# EAGLE schematic PIClab1 (EAGLE 7.5.0)

## Sheet 1 of 2
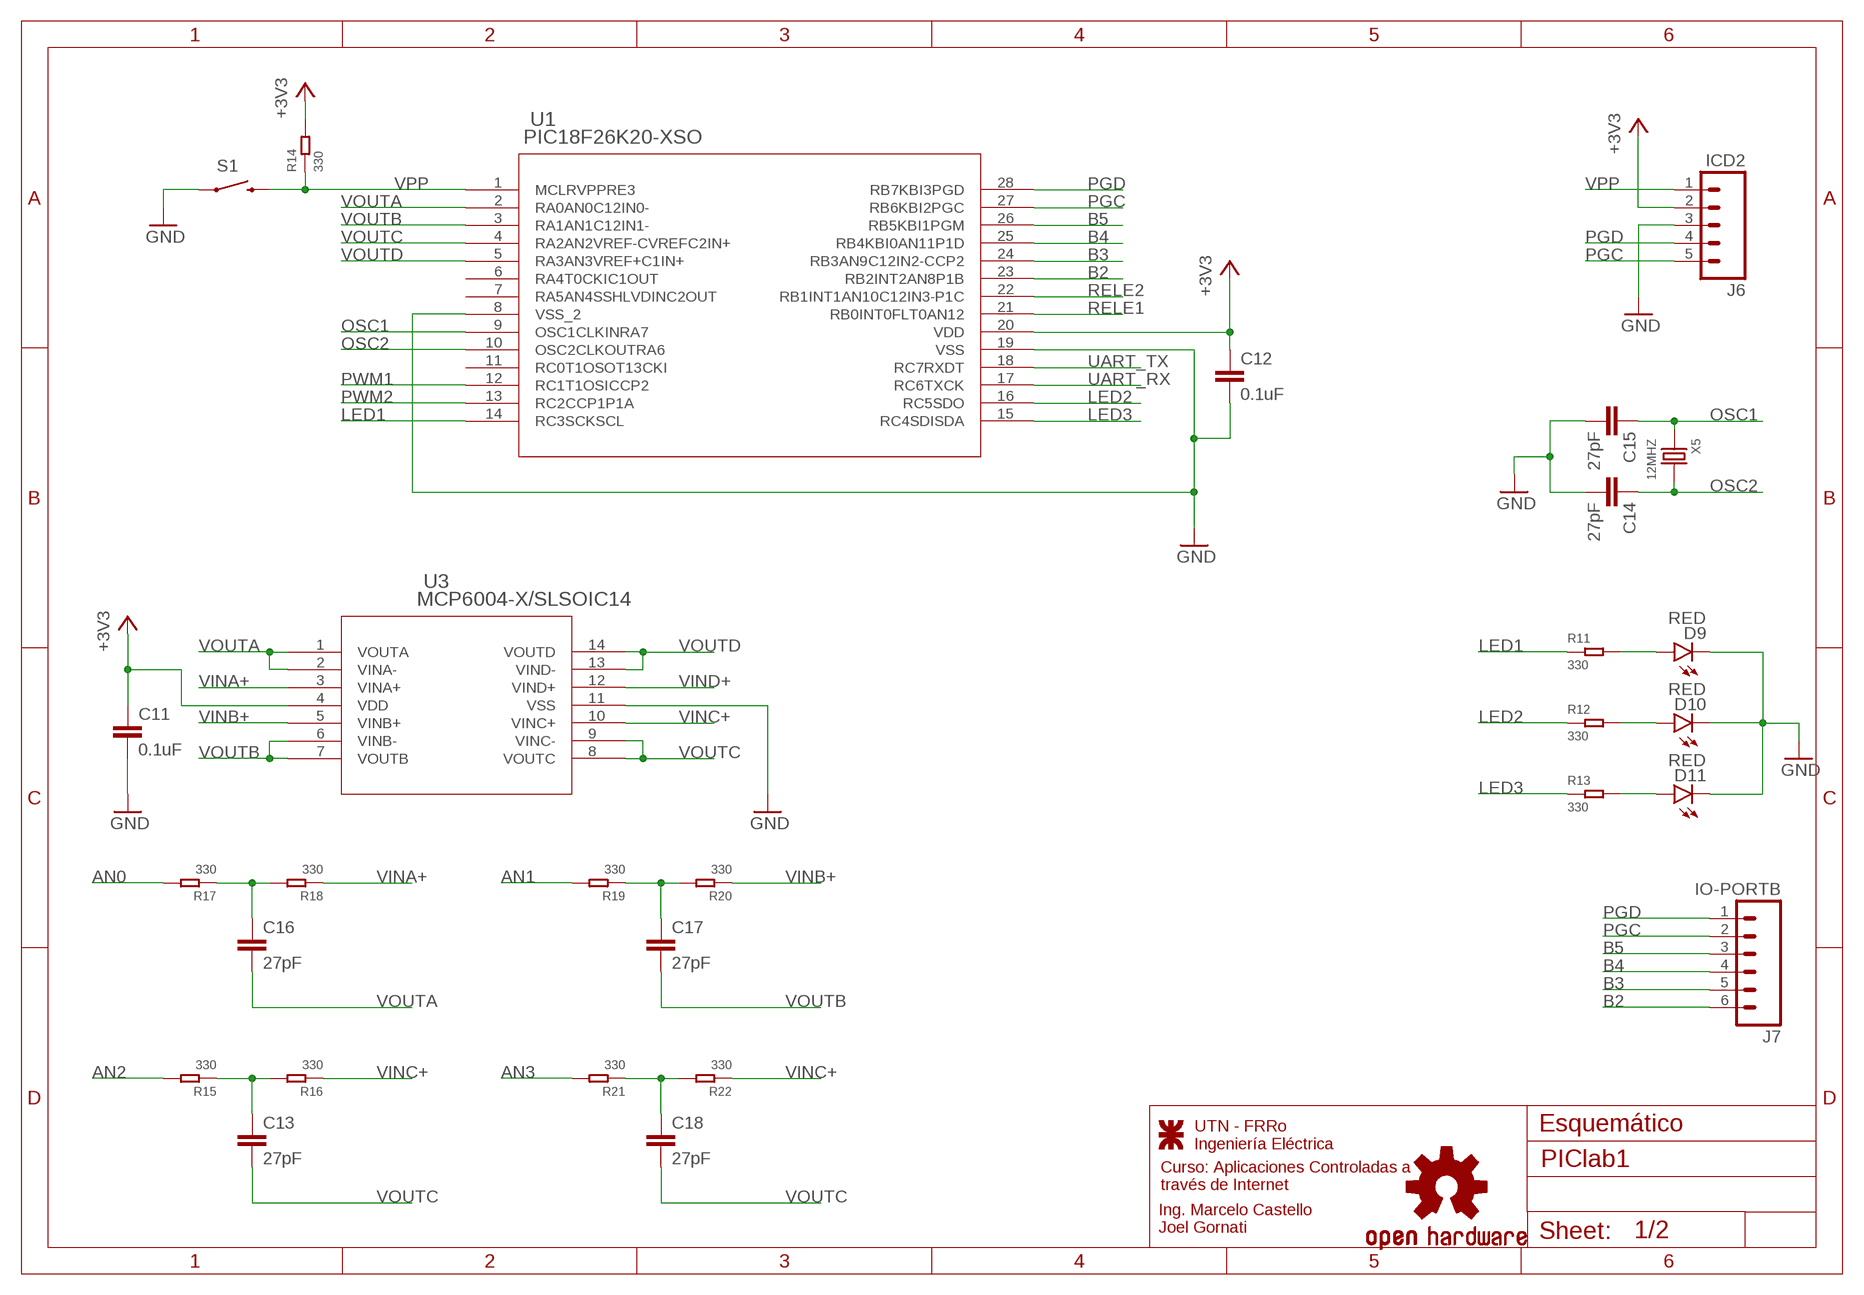
[diagram p0: schematic, sheet 1]

### Parts
C11  0.1uF  CAP1206  [1206]
C12  0.1uF  CAP1206  [1206]
C13  27pF  CAP1206  [1206]
C14  27pF  CAP1206  [1206]
C15  27pF  CAP1206  [1206]
C16  27pF  CAP1206  [1206]
C17  27pF  CAP1206  [1206]
C18  27pF  CAP1206  [1206]
D9  RED  LED-REDLILYPAD  [LED-1206]
D10  RED  LED-REDLILYPAD  [LED-1206]
D11  RED  LED-REDLILYPAD  [LED-1206]
J6  ICD2  M05PTH  [1X05]
J7  IO-PORTB  M06SILK_FEMALE_PTH  [1X06]
LOGO2  OSHW-LOGOMINI  [OSHW-LOGO-MINI]
R11  330  RES-1206  [R1206]
R12  330  RES-1206  [R1206]
R13  330  RES-1206  [R1206]
R14  330  RES-1206  [R1206]
R15  330  RES-1206  [R1206]
R16  330  RES-1206  [R1206]
R17  330  RES-1206  [R1206]
R18  330  RES-1206  [R1206]
R19  330  RES-1206  [R1206]
R20  330  RES-1206  [R1206]
R21  330  RES-1206  [R1206]
R22  330  RES-1206  [R1206]
S1  SWITCH-MOMENTARY-2SMD-4  [TACTILE_SWITCH_TALL]
U1  PIC18F26K20-XSO  [SOIC28-W_MC]
U3  MCP6004-X/SLSOIC14  [SOIC14-N_MC]
U$3  UTNLOGO  [UTNLOGO]
X5  12MHZ  CRYSTAL'HC49UP'  [HC49UP]

### Nets
+3V3: C11.1 C12.1 J6.2 R14.2 U1.20(VDD) U3.4(VDD) ; also sheet 2
AN0: R17.2
AN1: R19.2
AN2: R15.2
AN3: R21.2
B2: J7.6 U1.23(RB2INT2AN8P1B)
B3: J7.5 U1.24(RB3AN9C12IN2-CCP2)
B4: J7.4 U1.25(RB4KBI0AN11P1D)
B5: J7.3 U1.26(RB5KBI1PGM)
GND: C11.2 C12.2 C14.2 C15.2 D9.C D10.C D11.C J6.3 S1.A2 U1.8(VSS_2) U1.19(VSS) U3.11(VSS) ; also sheet 2
LED1: R11.1 U1.14(RC3SCKSCL)
LED2: R12.1 U1.16(RC5SDO)
LED3: R13.1 U1.15(RC4SDISDA)
N$13: C13.1 R15.1 R16.2
N$20: C17.1 R19.1 R20.2
N$21: C18.1 R21.1 R22.2
N$23: D9.A R11.2
N$24: D10.A R12.2
N$25: D11.A R13.2
N$27: C16.1 R17.1 R18.2
OSC1: C15.1 U1.9(OSC1CLKINRA7) X5.1
OSC2: C14.1 U1.10(OSC2CLKOUTRA6) X5.2
PGC: J6.5 J7.2 U1.27(RB6KBI2PGC)
PGD: J6.4 J7.1 U1.28(RB7KBI3PGD)
PWM1: U1.12(RC1T1OSICCP2)
PWM2: U1.13(RC2CCP1P1A)
RELE1: U1.21(RB0INT0FLT0AN12) ; also sheet 2
RELE2: U1.22(RB1INT1AN10C12IN3-P1C) ; also sheet 2
UART_RX: U1.17(RC6TXCK) ; also sheet 2
UART_TX: U1.18(RC7RXDT) ; also sheet 2
VINA+: R18.1 U3.3(VINA+)
VINB+: R20.1 U3.5(VINB+)
VINC+: R16.1 R22.1 U3.10(VINC+)
VIND+: U3.12(VIND+)
VOUTA: C16.2 U1.2(RA0AN0C12IN0-) U3.1(VOUTA) U3.2(VINA-)
VOUTB: C17.2 U1.3(RA1AN1C12IN1-) U3.6(VINB-) U3.7(VOUTB)
VOUTC: C13.2 C18.2 U1.4(RA2AN2VREF-CVREFC2IN+) U3.8(VOUTC) U3.9(VINC-)
VOUTD: U1.5(RA3AN3VREF+C1IN+) U3.13(VIND-) U3.14(VOUTD)
VPP: J6.1 R14.1 S1.B2 U1.1(MCLRVPPRE3)
Unconnected: U1.6(RA4T0CKIC1OUT) U1.7(RA5AN4SSHLVDINC2OUT) U1.11(RC0T1OSOT13CKI)

### Notes on the sheet
- UTN - FRRo | Esquemático
- Ingeniería Eléctrica
- Curso: Aplicaciones Controladas a 
  través de Internet
- Ing. Marcelo Castello
  Joel Gornati

## Sheet 2 of 2
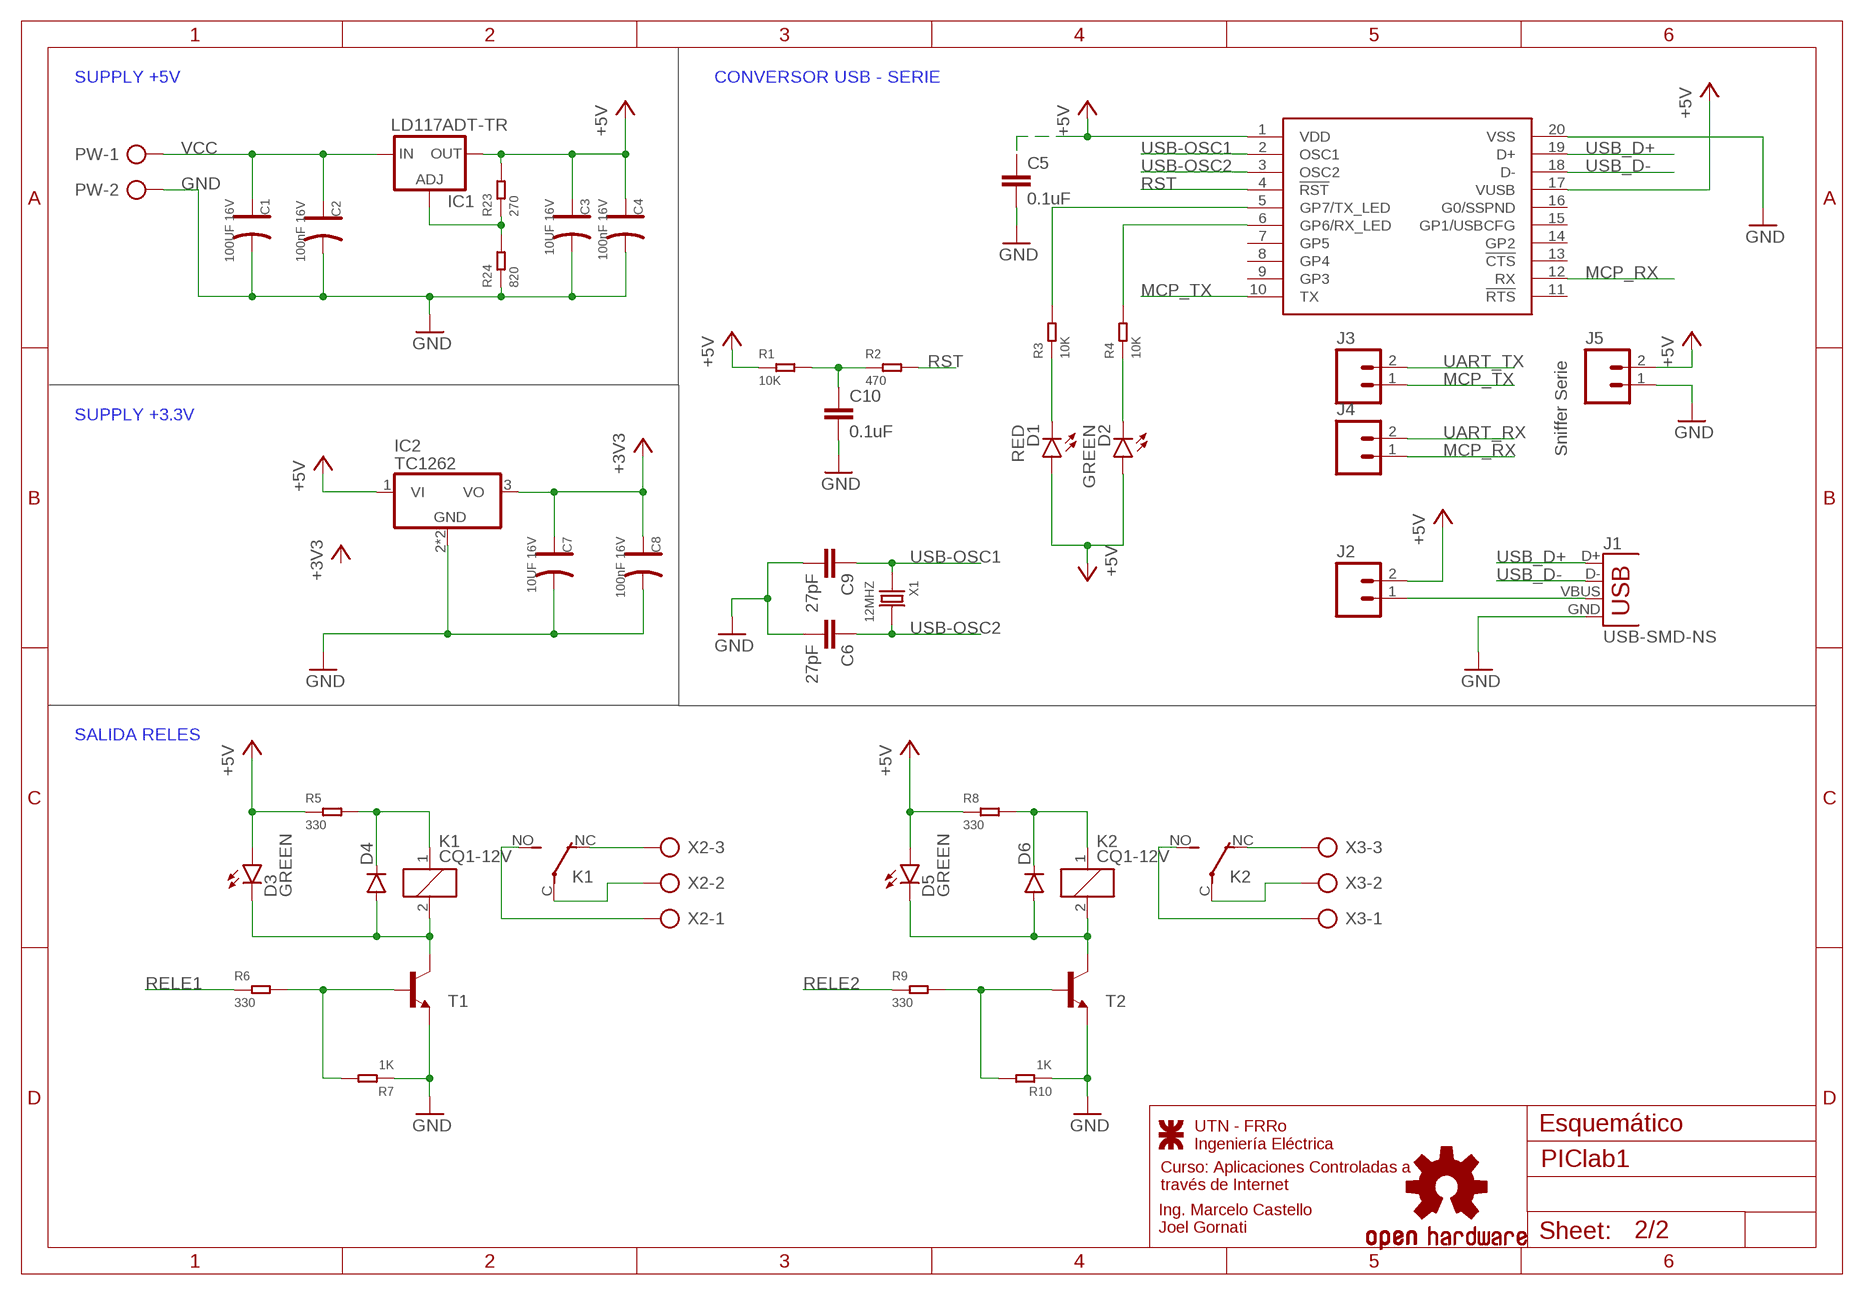
[diagram p1: schematic, sheet 2]

### Parts
C1  100UF 16V  ALUMINUM-SMD-10UF-16V  [ELECTRO-SMD-A-3.8MM]
C2  100nF 16V  ALUMINUM-SMD-10UF-16V  [ELECTRO-SMD-A-3.8MM]
C3  10UF 16V  ALUMINUM-SMD-10UF-16V  [ELECTRO-SMD-A-3.8MM]
C4  100nF 16V  ALUMINUM-SMD-10UF-16V  [ELECTRO-SMD-A-3.8MM]
C5  0.1uF  CAP1206  [1206]
C6  27pF  CAP1206  [1206]
C7  10UF 16V  ALUMINUM-SMD-10UF-16V  [ELECTRO-SMD-A-3.8MM]
C8  100nF 16V  ALUMINUM-SMD-10UF-16V  [ELECTRO-SMD-A-3.8MM]
C9  27pF  CAP1206  [1206]
C10  0.1uF  CAP1206  [1206]
D1  RED  LED-REDLILYPAD  [LED-1206]
D2  GREEN  LED-REDLILYPAD  [LED-1206]
D3  GREEN  LED-REDLILYPAD  [LED-1206]
D4  DIODEHV  [DIODE-HV]
D5  GREEN  LED-REDLILYPAD  [LED-1206]
D6  DIODEHV  [DIODE-HV]
IC1  LD117ADT-TR  [DPACK]
IC2  TC1262  [SOT223]
J1  USB-SMD-NS  [USB-MINIB-NOSTOP]
J2  M02PTH  [1X02]
J3  M02PTH  [1X02]
J4  M02PTH  [1X02]
J5  M02PTH  [1X02]
K1  CQ1-12V  [CQ1]
K2  CQ1-12V  [CQ1]
LOGO1  OSHW-LOGOMINI  [OSHW-LOGO-MINI]
PW  AK300/2  [AK300/2]
R1  10K  RES-1206  [R1206]
R2  470  RES-1206  [R1206]
R3  10K  RES-1206  [R1206]
R4  10K  RES-1206  [R1206]
R5  330  RES-1206  [R1206]
R6  330  RES-1206  [R1206]
R7  1K  RES-1206  [R1206]
R8  330  RES-1206  [R1206]
R9  330  RES-1206  [R1206]
R10  1K  RES-1206  [R1206]
R23  270  RES-1206  [R1206]
R24  820  RES-1206  [R1206]
T1  BC817-25-NPN-SOT23-BEC  [SOT23-BEC]
T2  BC817-25-NPN-SOT23-BEC  [SOT23-BEC]
U2  MCP2200SOIC  [MCP2200]
U$2  UTNLOGO  [UTNLOGO]
X1  12MHZ  CRYSTAL'HC49UP'  [HC49UP]
X2  AK500/3  [AK500/3]
X3  AK500/3  [AK500/3]

### Nets
+3V3: C7.+ C8.+ IC2.3(VO) ; also sheet 1
+5V: C3.+ C4.+ C5.1 D1.A D2.A D3.A D5.A IC1.4(OUT) IC2.1(VI) J2.2 J5.2 R1.1 R5.1 R8.1 R23.2 U2.1(VDD) U2.17(VUSB)
GND: C1.- C2.- C3.- C4.- C5.2 C6.2 C7.- C8.- C9.2 C10.2 IC2.2(GND) IC2.4(GND) J1.GND J5.1 PW.2 R7.1 R10.1 R24.1 T1.E T2.E U2.20(VSS) ; also sheet 1
MCP_RX: J4.1 U2.12(RX)
MCP_TX: J3.1 U2.10(TX)
N$1: C10.1 R1.2 R2.1
N$2: K1.C(2:P) X2.2
N$3: D2.C R4.1
N$4: D1.C R3.1
N$5: R3.2 U2.5(GP7/TX_LED)
N$6: R4.2 U2.6(GP6/RX_LED)
N$7: K1.NC(2:O) X2.3
N$8: K1.NO(2:S) X2.1
N$9: J1.VBUS J2.1
N$10: D3.C D4.A K1.2 T1.C
N$11: D4.C K1.1 R5.2
N$12: R6.2 R7.2 T1.B
N$14: K2.C(2:P) X3.2
N$15: K2.NC(2:O) X3.3
N$16: K2.NO(2:S) X3.1
N$17: D5.C D6.A K2.2 T2.C
N$18: D6.C K2.1 R8.2
N$19: R9.2 R10.2 T2.B
N$22: IC1.1(ADJ) R23.1 R24.2
RELE1: R6.1 ; also sheet 1
RELE2: R9.1 ; also sheet 1
RST: R2.2 U2.4(!RST)
UART_RX: J4.2 ; also sheet 1
UART_TX: J3.2 ; also sheet 1
USB-OSC1: C9.1 U2.2(OSC1) X1.1
USB-OSC2: C6.1 U2.3(OSC2) X1.2
USB_D+: J1.D+ U2.19(D+)
USB_D-: J1.D- U2.18(D-)
VCC: C1.+ C2.+ IC1.3(IN) PW.1
Unconnected: U2.7(GP5) U2.8(GP4) U2.9(GP3) U2.11(!RTS) U2.13(!CTS) U2.14(GP2) U2.15(GP1/USBCFG) U2.16(G0/SSPND)

### Notes on the sheet
- SUPPLY +5V | CONVERSOR USB - SERIE
- SUPPLY +3.3V
- Sniffer Serie
- SALIDA RELES
- UTN - FRRo | Esquemático
- Ingeniería Eléctrica
- Curso: Aplicaciones Controladas a 
  través de Internet
- Ing. Marcelo Castello
  Joel Gornati

## Library data of the parts
C1 C2 C4 C8 = Seeed-OPL-Capacitor:ALUMINUM-SMD-10UF-16V: 302030097; VALUE: 10UF 16V
C3 C7 = Seeed-OPL-Capacitor:ALUMINUM-SMD-10UF-16V: 302030097
C5 C6 C9-C18 = SparkFun-Passives:CAP: Capacitor Standard 0603 ceramic capacitor, and 0.1" leaded capacitor.
D1 D9-D11 = SparkFun-LED:LED-RED: Assorted Red LEDs LilyPad 1206- DIO-09912 1206- DIO-00809 0603- DIO-00819 "SMART" means more efficient and expensive; PROD_ID: DIO-09912
D2 D3 D5 = SparkFun-LED:LED-RED: Assorted Red LEDs LilyPad 1206- DIO-09912 1206- DIO-00809 0603- DIO-00819 "SMART" means more efficient and expensive; PROD_ID: DIO-09912; VALUE: RED
D4 D6 = SparkFun-DiscreteSemi:DIODE: Diode These are standard reverse protection diodes and small signal diodes. SMA package can handle up to about 1A. SOD-323 can handle about 200mA. What the SOD-323 package when ordering, there are some mfgs out there that are 5-pin packages.
IC1 = v-reg:LD117A?*: Low drop fixed and adjustable positive voltage regulators 1 A Source: http://www.st.com/stonline/products/literature/ds/7194/ld1117axx.pdf
IC2 = UTN-PCB:TC1262: 500mA Fixed Output CMOS LDO • Very Low Dropout Voltage • 500mA Output Current • High Output Voltage Accuracy • Standard or Custom Output Voltages • Over Current and Over Temperature Protection
J1 = SparkFun-Connectors:USB: USB Connectors USB-B-PTH is fully proven SKU : PRT-00139/CONN-08278 USB-miniB is fully proven SKU : PRT-00587 USB-A-PCB is untested. USB-A-H is throughly reviewed, but untested. Spark Fun Electronics SKU : PRT-00437 USB-B-SMT is throughly reviewed, but untested. Needs silkscreen touching up. USB-A-S has not been used/tested USB-MB-H has not been used/tested USB-MICROB has been used. CONN-09505
J2-J5 = SparkFun-Connectors:M02: Standard 2-pin 0.1" header. Use with - straight break away headers ( PRT-00116) - right angle break away headers (PRT-00553) - swiss pins (PRT-00743) - machine pins (PRT-00117) - female headers (PRT-00115) Molex polarized connector foot print use with: PRT-08233 with associated crimp pins and housings. 2.54_SCREWTERM for use with PRT-10571. 3.5mm Screw Terminal footprints for PRT-08084 5mm Screw Terminal footprints for use with PRT-08432
J6 = SparkFun-Connectors:M05: Header 5 Standard 5-pin 0.1" header. Use with straight break away headers (SKU : PRT-00116), right angle break away headers (PRT-00553), swiss pins (PRT-00743), machine pins (PRT-00117), and female headers (PRT-00115). Molex polarized connector foot print use with SKU : PRT-08230 with associated crimp pins and housings.
J7 = SparkFun-Connectors:M06: Header 6 Standard 6-pin 0.1" header. Use with straight break away headers (SKU : PRT-00116), right angle break away headers (PRT-00553), swiss pins (PRT-00743), machine pins (PRT-00117), and female headers (PRT-00115). Molex polarized connector foot print use with SKU : PRT-08094 with associated crimp pins and housings. NOTES ON THE VARIANTS LOCK and LOCK_LONGPADS... This footprint was designed to help hold the alignment of a through-hole component (i.e. 6-pin header) while soldering it into place. You may notice that each hole has been shifted either up or down by 0.005 of an inch from it's more standard position (which is a perfectly straight line). This slight alteration caused the pins (the squares in the middle) to touch the edges of the holes. Because they are alternating, it causes a "brace" to hold the component in place. 0.005 has proven to be the perfect amount of "off-center" position when using our standard breakaway headers. Although looks a little odd when you look at the bare footprint, once you have a header in there, the alteration is very hard to notice. Also,if you push a header all the way into place, it is covered up entirely on the bottom side. This idea of altering the position of holes to aid alignment will be further integrated into the Sparkfun Library for other footprints. It can help hold any component with 3 or more connection pins.; PROD_ID: CONN-08437
K1 K2 = relay:CQ1-12V: AUTOMOTIVE QUIET RELAY NAiS Source: http://www.mew-europe.com/.. en_ds_61208_0000.pdf; OC_FARNELL: unknown; OC_NEWARK: unknown
LOGO1 LOGO2 = SparkFun-Aesthetics:OSHW-LOGO: Open Source Hardware Logo This logo indicates the piece of hardware it is found on incorporates a OSHW license and/or adheres to the definition of open source hardware found here: http://freedomdefined.org/OSHW
PW = con-ptr500:AK300/2: CONNECTOR; OC_FARNELL: unknown; OC_NEWARK: unknown
R1-R24 = Seeed-OPL-Resistor:RES
S1 = SparkFun-Electromechanical:SWITCH-MOMENTARY-2: Various NO switches- pushbuttons, reed, etc; PROD_ID: SWCH-11966
T1 T2 = transistor-neu-to92:*-NPN-: NPN Transistror
U1 = UTN-PCB:PIC18F26K20-XSO
U2 = UTN-PCB:MCP2200: USB to serial converter by micreochip
U3 = UTN-PCB:MCP6004-X/SL
U$2 U$3 = UTN-PCB:UTNLOGO
X1 X5 = Seeed-OPL-Crystal-Oscillator:CRYSTAL
X2 X3 = con-ptr500:AK500/3: CONNECTOR; OC_FARNELL: unknown; OC_NEWARK: unknown